# EasyEDA Pro project legacy_final.eprj, schematic Schematic4
Board Name: Schematic4; Create Date: 2026-05-15; Page Name: P1; Project Name: final; Schematic Name: Schematic4; Update Date: 2026-05-28
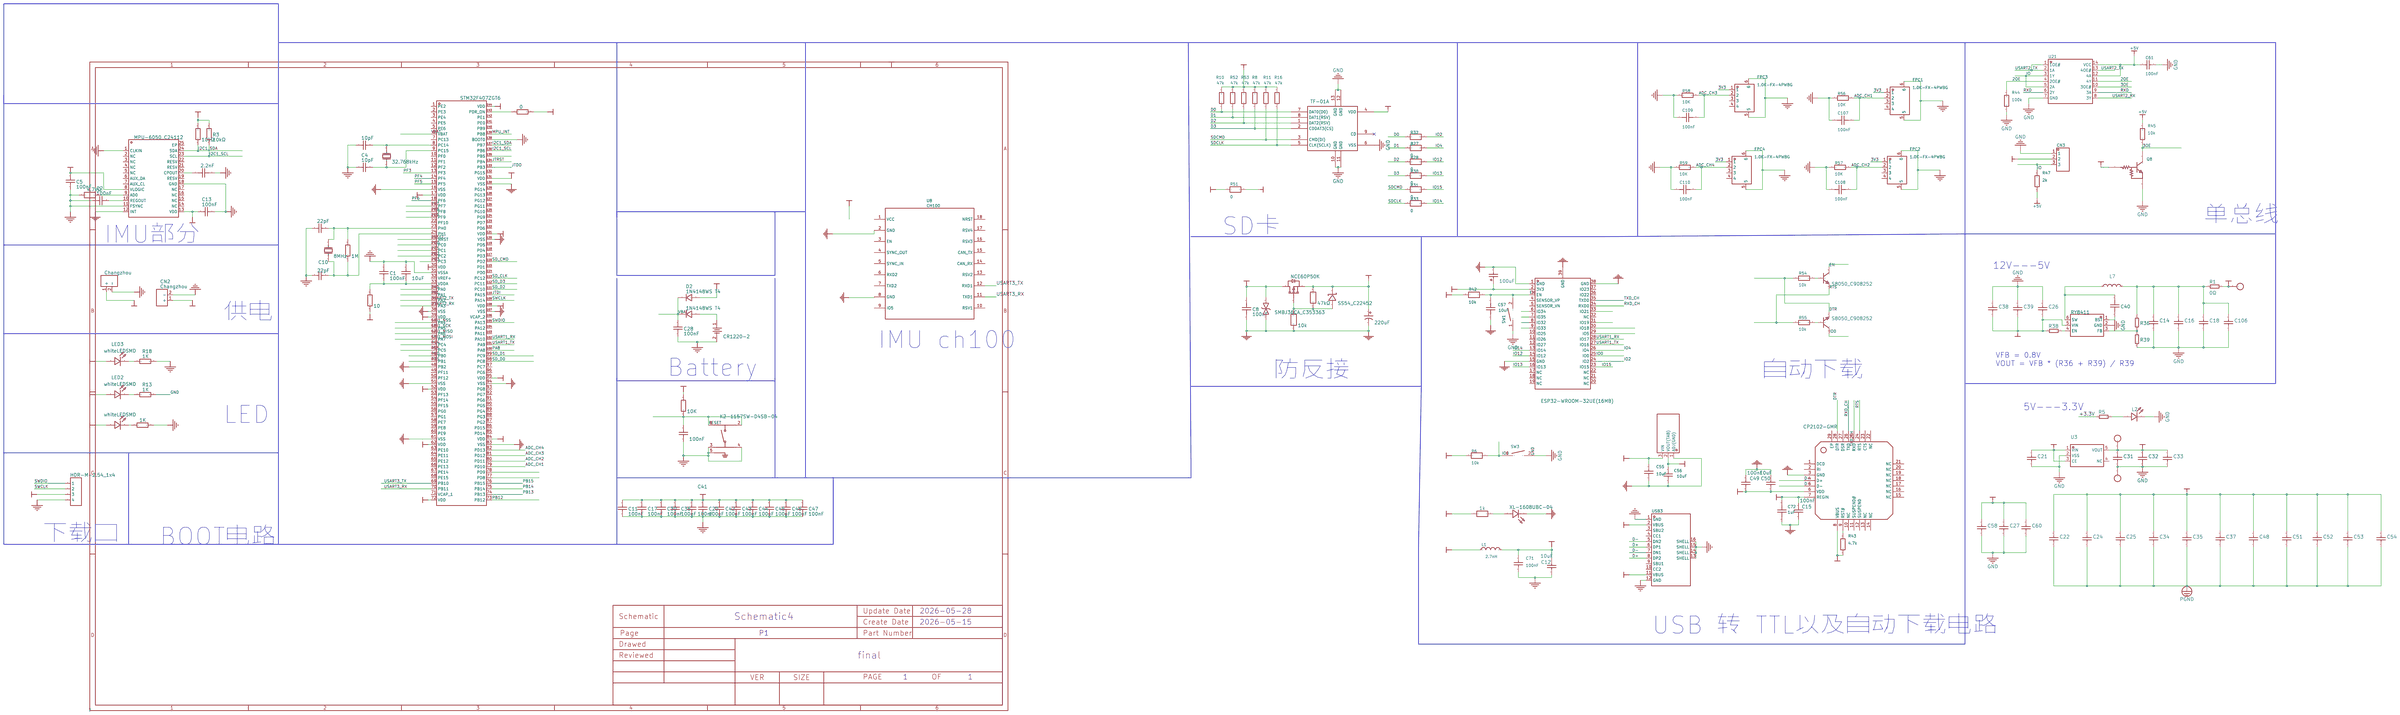
[diagram p0: schematic sheet]

## Parts
B1  CR1220-2  [BAT-SMD_CR1220-2]
C1  100nF  [C0402_NEW(1)]
C2  100nF  [C0402_NEW(1)]
C3  10pF  [C0603]
C4  10pF  [C0603]
C5  100nF  [C0402_NEW(1)]
C6  2.2nF  [C0603]
C7  22pF  [C0402]
C8  100nF  [C0805]
C9  100nF  [C0805]
C10  22pF  [C0402]
C11  100nF  [C0402_NEW(1)]
C12  10uF  [C0402(1)]
C13  100nF  [C0402_NEW(1)]
C14  100nF  [C0603_S]
C15  100nF  [C0402(1)]
C16  100nF  [C0603_S]
C17  100nF  [C0402_NEW(1)]
C18  100nF  [C0603_S]
C19  220uF  [CAP-TH_BD6.3-P2.50-D1.0-FD]
C20  100nF  [C0402_NEW(1)]
C21  100nF  [C0603_S]
C22  10uF  [C1206_S]
C23  100uF  [CAP-SMD_L3.5-W2.8-R-RD]
C24  10uF  [C1206_S]
C25  10uF  [C1206_S]
C26  100nF  [C0603_S]
C27  10uF  [C0603_S]
C28  100nF  [C0805]
C29  10uF  [C0805]
C30  100nF  [C0402_NEW(1)]
C31  100nF  [C0603_S]
C32  100nF  [C0603_S]
C33  100nF  [C0603_S]
C34  10uF  [C1206_S]
C35  10uF  [C1206_S]
C36  100nF  [C0402_NEW(1)]
C37  10uF  [C1206_S]
C38  10uF  [C0603_S]
C39  10uF  [C0603_S]
C40  100nF  [C0603_S_3]
C41  100nF  [C0402_NEW(1)]
C42  100nF  [C0402_NEW(1)]
C43  100nF  [C0402_NEW(1)]
C44  100nF  [C0402_NEW(1)]
C45  100nF  [C0402_NEW(1)]
C46  100nF  [C0402_NEW(1)]
C47  100nF  [C0402_NEW(1)]
C48  10uF  [C1206_S]
C49  100nF  [C0402(1)]
C50  10uF  [C0402(1)]
C51  10uF  [C1206_S]
C52  10uF  [C1206_S]
C53  10uF  [C1206_S]
C54  10uF  [C1206_S]
C55  10uF  [C0402_1]
C56  10uF  [C0402_1]
C57  10uF  [C0805_1]
C58  10uF  [C0603_S]
C60  10uF  [C0603_S]
C61  100nF  [C0402_NEW_1]
C71  100nF  [C0402_NEW_1]
C72  1uF  [C0402_1]
C106  100nF  [C0603_S]
C107  100nF  [C0603]
C108  100nF  [C0603]
C109  100nF  [C0603]
C110  100nF  [C0603]
CARD1  TF-01A  [TF-SMD_TF-01A]
CN1  Changzhou  [CONN-TH_XT30UPB-F]
CN2  Changzhou  [CONN-TH_XT30UPB-F(1)]
CN3  PH-3AW  [CONN-TH_PH-3AW]
CN5  5012  [TESTPOINT-TH_BD2.0_C9900010656]  (no BOM)
CN6  5012  [TESTPOINT-TH_BD2.0_C9900010656]  (no BOM)
CN7  5012  [TESTPOINT-TH_BD2.0_C9900010656]  (no BOM)
D1  SMBJ36CA_C353363  [SMB_L4.6-W3.6-LS5.3-BI]
D2  1N4148WS T4  [SOD-323_L1.8-W1.3-LS2.5-RD]
D3  1N4148WS T4  [SOD-323_L1.8-W1.3-LS2.5-RD]
D4  SS54_C22452  [SMA_L4.4-W2.8-LS5.4-R-RD]
FPC1  1.0K-FX-4PWBG  [CONN-SMD_1.0K-FX-4PWBG]
FPC2  1.0K-FX-4PWBG  [CONN-SMD_1.0K-FX-4PWBG]
FPC3  1.0K-FX-4PWBG  [CONN-SMD_1.0K-FX-4PWBG]
FPC4  1.0K-FX-4PWBG  [CONN-SMD_1.0K-FX-4PWBG]
J4  HDR-M-2.54_1x4  [HDR-M-2.54_1X4]
L1  2.7nH  [L0603]
L2  NCD0603R1  [LED0603_S]
L7  4.7uH  [IND-SMD_L2.5-W2.0]
LED2  whiteLEDSMD  [LED-0805]
LED3  whiteLEDSMD  [LED-0805]
LED6  XL-1608UBC-04  [LED0603-RD_BLUE]
LED7  whiteLEDSMD  [LED-0805]
Q1  NCE60P50K  [TO-252-2_L6.6-W6.1-P4.57-LS9.9-BR-CW]
Q2  S8050_C908252  [SOT-23-3_L2.9-W1.3-P1.90-LS2.4-BR]
Q5  S8050_C908252  [SOT-23-3_L2.9-W1.3-P1.90-LS2.4-BR]
Q8  LMUN2232LT1G  [SOT-23-3_L2.9-W1.3-P1.90-LS2.4-BR_1]
R1  0Ω  [R0603_S]
R2  10kΩ  [R0402]
R3  10kΩ  [R0402]
R4  4.7kΩ  [R0603]
R5  1kΩ  [R0603_S]
R6  10k  [R0402_1]
R7  10K  [R0805]
R8  47k  [R0402_2]
R9  1M  [R0603]
R10  47k  [R0402_2]
R11  47k  [R0402_2]
R12  10  [R0805]
R13  1K  [R0603]
R14  47kΩ  [R0805]
R15  0  [R0603]
R16  47k  [R0402_2]
R17  10k  [R0805]
R18  1K  [R0603]
R27  0  [R0603_1]
R28  0  [R0603_1]
R29  1K  [R0603]
R30  0  [R0603_1]
R31  0  [R0603_1]
R32  0  [R0603_1]
R33  0  [R0603_1]
R36  62kΩ  [R0603_S]
R37  1k  [R0603]
R38  10kΩ  [R0603_S]
R39  12kΩ  [R0603_S]
R42  10k  [R0402_1]
R43  4.7k  [R0402_1]
R44  100k  [R0603_1]
R45  10k  [R0402_1]
R47  2k  [R0402_2]
R51  0  [R0603_1]
R52  47k  [R0402_2]
R53  47k  [R0402_2]
R54  10k  [R0402_1]
R55  10k  [R0402_1]
R56  10K  [R0603]
R57  10K  [R0603]
R58  10K  [R0603]
R59  10K  [R0603]
SW1  TSA343G00-250J2  [SW-SMD_L4.0-W2.9-LS5.0]
SW2  K2-1157SW-D4SB-04  [KEY-SMD_4P-L6.2-W6.5-P4.50-LS8.0_K2-1157SW-XX]
SW3  TSA343G00-250J2  [SW-SMD_L4.0-W2.9-LS5.0]
U2  STM32F407ZGT6  [LQFP-144_L20.0-W20.0-P0.50-LS22.0-BL]
U3  XC6210B332MR  [SOT-23-5_L3.0-W1.7-P0.95-LS2.8-BR]
U4  MPU-6050_C24112  [QFN-24_L4.0-W4.0-P0.50-BL-EP2.6]
U5  RY8411  [SOT-23-6_L2.9-W1.6-P0.95-LS2.8-BR]
U6  ESP32-WROOM-32UE(16MB)  [WIFI-SMD_ESP32-WROOM-32UE]
U7  AMS1117-3.3_C347256  [SOT-89_L4.5-W2.5-P1.50-LS4.2-BR]
U8  CH100  [CH100-18]
U19  CP2102-GMR  [CP2102]
U21  SN74HC125PWR  [TSSOP-14_L5.0-W4.4-P0.65-LS6.5-BL]
USB3  TYPE-C-31-M-22  [USB-C-SMD_TYPE-C-31-M-22]
X2  8MHz  [OSC-SMD_L5.0-W3.2]
X3  32.768kHz  [OSC-SMD_L2.0-W1.2]

## Library data of the parts
B1 = CR1220-2: Supplier: LCSC; Manufacturer: Q&amp;J; image: //image.lceda.cn/szlcsc/C70381.jpg; Supplier Part: C70381; Paste Type: expand
C1 C2 C5 C11 C13 C17 C20 C30 C36 C41-C47 = 100nF_C0402_NEW: Supplier: LCSC; Manufacturer Part: CL05B104KO5NNNC; Manufacturer: SAMSUNG(三星); Supplier Part: C1525; Paste Type: base; JLCPCB Part Class: Basic Part
C3 = 10pF: Supplier: LCSC; Manufacturer Part: CL10C100JB8NNNC; Manufacturer: SAMSUNG(三星); Supplier Part: C1634; JLCPCB Part Class: Basic Part
C4 = 10pF_C0603: Supplier: LCSC; Manufacturer Part: CL10C100JB8NNNC; Manufacturer: SAMSUNG(三星); Supplier Part: C1634; JLCPCB Part Class: Basic Part
C6 = 2.2nF: Supplier: LCSC; Supplier Part: C882578; Manufacturer: muRata(村田); Manufacturer Part: GCM1885C1H222FA16D; JLCPCB Part Class: Extended Part
C7 = 22pF: Supplier: LCSC; Manufacturer: FH; Manufacturer Part: 0402CG220J500NT; Supplier Part: C1555; JLCPCB Part Class: Basic Part
C8 = 100nF_C0805: Supplier: LCSC; Manufacturer: MuRata; Manufacturer Part: GRM21BR71H104KA01L; Supplier Part: C77082; Paste Type: base; JLCPCB Part Class: Extended Part
C9 C28 = 100nF_C0805(1): Supplier: LCSC; Manufacturer Part: CC0805KRX7R9BB104; Manufacturer: YAGEO; Supplier Part: C49678; Paste Type: base
C10 = 22pF_C0402: Supplier: LCSC; Manufacturer: FH; Manufacturer Part: 0402CG220J500NT; Supplier Part: C1555; JLCPCB Part Class: Basic Part
C12 C50 = 10uF_C0402: Supplier: LCSC; Manufacturer Part: CL05A106MQ5NUNC; Manufacturer: SAMSUNG; Supplier Part: C15525; Paste Type: base; JLCPCB SMD: Yes
C14 C16 C18 C21 C26 C31-C33 C106 = 0603B104K500NT: LCSC Part Name: 100nF ±10% 50V; Supplier Part: C30926; Manufacturer: FH(风华); Supplier Footprint: 0603; JLCPCB Part Class: Extended Part; Datasheet: https://atta.szlcsc.com/upload/public/pdf/source/20200305/C486355_26A10D38EF8C2A5C37091D0039909270.pdf; Supplier: LCSC; Tolerance: ±10%; Voltage Rated: 50V; Temperature Coefficient: X7R; Pin Type: IN; Check: true
C15 C49 = 100nF_C0402: Supplier: LCSC; Manufacturer Part: CL05B104KO5NNNC; Manufacturer: SAMSUNG; Supplier Part: C1525; Paste Type: base; JLCPCB SMD: Yes
C19 = 220uF: Supplier: LCSC; Manufacturer: ValuePro; Manufacturer Part: 220uF 16V Black high frequency; Supplier Part: C35799; JLCPCB Part Class: Extended Part
C22 C24 C25 C34 C35 C37 C48 C51-C54 = CL31A106KBHNNNE: LCSC Part Name: 10uF ±10% 50V; Supplier Part: C13585; Manufacturer: SAMSUNG(三星); Supplier Footprint: 1206; JLCPCB Part Class: Basic Part; Datasheet: https://atta.szlcsc.com/upload/public/pdf/source/20160218/1457707763339.pdf; Supplier: LCSC; Tolerance: ±10%; Voltage Rated: 50V; Temperature Coefficient: X5R; Pin Type: IN; 值: 10UF; Check: true
C23 = 100uF: Supplier: LCSC; Manufacturer: Xiangyee; Manufacturer Part: CA45-B010K107T; Supplier Part: C122644; JLCPCB Part Class: Extended Part
C27 C38 C39 C58 C60 = CL10A106MA8NRNC: LCSC Part Name: 10uF ±20% 25V; Supplier Part: C96446; Manufacturer: SAMSUNG(三星); Supplier Footprint: 0603; JLCPCB Part Class: Basic Part; Datasheet: https://atta.szlcsc.com/upload/public/pdf/source/20160218/1457707763339.pdf; Supplier: LCSC; Tolerance: ±20%; Voltage Rated: 25V; Temperature Coefficient: X5R; Pin Type: IN; Check: true
C29 = 10uF_C0805: Supplier: LCSC; Manufacturer Part: CL21A106KAYNNNE; Manufacturer: SAMSUNG; Supplier Part: C15850; Paste Type: base
C40 = CC0603KRX7R9BB104: LCSC Part Name: 100nF ±10% 50V; Supplier Part: C14663; Manufacturer: YAGEO(国巨); Supplier Footprint: 0603; JLCPCB Part Class: Basic Part; Datasheet: https://atta.szlcsc.com/upload/public/pdf/source/20180910/C282072_33301C7F631E79921B82A8DAC6BCC5B3.pdf; Supplier: LCSC; Tolerance: ±10%; Voltage Rated: 50V; Temperature Coefficient: X7R; Check: true
C55 C56 = CL05A106MQ5NUNC: LCSC Part Name: 10uF ±20% 6.3V; Supplier Part: C15525; Manufacturer: SAMSUNG(三星); Supplier Footprint: 0402; Datasheet: https://atta.szlcsc.com/upload/public/pdf/source/20220823/2B02EE04F8F211D38A52DCB16EB6BEBA.pdf; Supplier: LCSC; Tolerance: ±20%; Voltage Rated: 6.3V; Temperature Coefficient: X5R
C57 = GRM21BR61H106KE43L: LCSC Part Name: 10uF ±10% 50V; Supplier Part: C440198; Manufacturer: muRata(村田); Supplier Footprint: 0805; Datasheet: https://atta.szlcsc.com/upload/public/pdf/source/20191220/C440198_2DEA1B9834E321C8893F7972E9DFE5B0.pdf; Supplier: LCSC; Tolerance: ±10%; Voltage Rated: 50V; Temperature Coefficient: X5R
C61 C71 = CL05B104KO5NNNC: LCSC Part Name: 100nF ±10% 16V; Supplier Part: C1525; Manufacturer: SAMSUNG(三星); Supplier Footprint: 0402; Datasheet: https://atta.szlcsc.com/upload/public/pdf/source/20160103/1457707674891.pdf; Supplier: LCSC; Tolerance: ±10%; Voltage Rated: 16V; Temperature Coefficient: X7R
C72 = CL05A105KA5NQNC: LCSC Part Name: 1uF ±10% 25V; Supplier Part: C52923; Manufacturer: SAMSUNG(三星); Supplier Footprint: 0402; Datasheet: https://atta.szlcsc.com/upload/public/pdf/source/20160103/1457707735223.pdf; Supplier: LCSC; Tolerance: ±10%; Voltage Rated: 25V; Temperature Coefficient: X5R
C107-C110 = CAP_0603: Supplier Footprint: 0603
CARD1 = TF-01A: Supplier: LCSC; Manufacturer: HRO; Supplier Part: C91145
CN1 = Changzhou: Supplier: LCSC; Supplier Part: C108769; Manufacturer: Changzhou Amass Elec; Manufacturer Part: XT30UPB-F; JLCPCB Part Class: Extended Part
CN2 = Changzhou_CONN-TH_XT30UPB-F: Supplier: LCSC; Supplier Part: C108769; Manufacturer: Changzhou Amass Elec; Manufacturer Part: XT30UPB-F; JLCPCB Part Class: Extended Part
CN3 = PH-3AW_C10400: LCSC Part Name: PH 2mm 1x3P 卧插; Supplier Part: C10400; Manufacturer: BOOMELE(博穆精密); Supplier Footprint: 弯插,P=2mm; Datasheet: https://atta.szlcsc.com/upload/public/pdf/source/20151118/1457707577338.pdf; Supplier: LCSC; Reference Series: PH; Pitch: 2mm; Pins Structure: 1x3P; Number of Rows: 1; Number of PINs Per Row: 3
CN5-CN7 = 5012: LCSC Part Name: 测试点; Supplier Part: C2906766; Manufacturer: Keystone; JLCPCB Part Class: ExtendedPart; Datasheet: https://atta.szlcsc.com/upload/public/pdf/source/20211102/12102DF701EA335825673F0350517149.pdf; Supplier: LCSC; Check: true
D1 = SMBJ36CA_C353363: Supplier: LCSC; Supplier Part: C353363; Manufacturer: 晶导微电子; Manufacturer Part: SMBJ36CA; JLCPCB Part Class: Extended Part
D2 = 1N4148WS T4_SOD-323_L1.8-W1.3-LS2.5-RD: Supplier: LCSC; Manufacturer: CJ; image: //image.lceda.cn/szlcsc/C2128.jpg; Supplier Part: C2128; Paste Type: base
D3 = 1N4148WS T4: Supplier: LCSC; Manufacturer: CJ; image: //image.lceda.cn/szlcsc/C2128.jpg; Supplier Part: C2128; Paste Type: base
D4 = SS54_C22452: Supplier: LCSC; Manufacturer Part: SS54; Manufacturer: MDD; Supplier Part: C22452; JLCPCB Part Class: Basic Part
FPC1-FPC4 = 1.0K-FX-4PWBG: LCSC Part Name: 间距:1mm P数:4P 抽屉式 下接; Supplier Part: C2914091; Manufacturer: HDGC(华德共创); Supplier Footprint: SMD,P=1mm,卧贴; JLCPCB Part Class: 扩展库; Datasheet: https://item.szlcsc.com/datasheet/1.0K-FX-4PWBG/3200855.html; Supplier: LCSC; Locking Feature: 抽屉式; Contact Type: 下接; Number of Contacts: 4P; Pitch: 1mm; Mounting Type: 卧贴; FFC, FCB Thickness: 0.3mm; Height Above Board: 2.5mm; Operating Temperature: -20℃~+85℃
J4 = HDR-M-2.54_1x4: Supplier Part: C358686; Supplier: LCSC; Manufacturer: MINTRON; Manufacturer Part: MTP125-1104S1
L1 = VHF160808H2N7ST: 电感值:2.7nH;精度:±0.3nH;额定电流:400mA;饱和电流(Isat):-;直流电阻(DCR):200m;; LCSC Part Name: 2.7nH ±0.3nH 400mA 200m; Supplier Part: C83929; Manufacturer: FH(风华); Supplier Footprint: 0603; Datasheet: https://atta.szlcsc.com/upload/public/pdf/source/20161024/1477288574938.pdf; Supplier: LCSC; Tolerance: ±0.3nH; Rated Current: 400mA; DC Resistance (DCR): 200m
L2 = NCD0603R1_C84263: LCSC Part Name: 红灯 0603红灯   正贴; Supplier Part: C84263; Manufacturer: 国星光电; Supplier Footprint: 0603; JLCPCB Part Class: Extended Part; Datasheet: https://atta.szlcsc.com/upload/public/pdf/source/20200820/C84263_DABC6A75E58F576973B407FDBA283D60.pdf; Supplier: LCSC; Emitted Color: 红色; Forward Voltage (VF): 1.6V~2.6V; Forward Current: 20mA; Power Dissipation: 65mW; Lens Color: 无色透明; Dominant Wavelength: 615nm~630nm; Luminous Intensity: 80mcd~220mcd; Viewing Angle: 130°; Operating Temperature: -30℃~+85℃; Check: true
L7 = MPIH252010-4R7M-LF: LCSC Part Name: 4.7uH ±20% 1A 275mΩ; Supplier Part: C490449; Manufacturer: microgate(麦捷科技); Supplier Footprint: SMD; JLCPCB Part Class: Extended Part; Datasheet: https://atta.szlcsc.com/upload/public/pdf/source/20200707/C490443_2060EC88E48E101AE91DC68C352BCAF4.pdf; Supplier: LCSC; Tolerance: ±20%; Rated Current: 1A; DC Resistance (DCR): 275mΩ; Check: true
LED2 LED3 = whiteLEDSMD_LED-0805: Supplier: LCSC; Manufacturer: KENTO; image: //image.lceda.cn/szlcsc/C34499.jpg; Supplier Part: C34499; Paste Type: base
LED6 = XL-1608UBC-04: Supplier: LCSC; Supplier Part: C965807; Manufacturer: XINGLIGHT(成兴光); JLCPCB Part Class: Extended Part
LED7 = whiteLEDSMD: Supplier: LCSC; Manufacturer: KENTO; image: //image.lceda.cn/szlcsc/C34499.jpg; Supplier Part: C34499; Paste Type: base
Q1 = NCE60P50K: Supplier: LCSC; Manufacturer: Ncepower; Supplier Part: C130104; JLCPCB Part Class: Extend
Q2 = S8050_C908252: Supplier: LCSC; Supplier Part: C908252; Manufacturer: FUXINSEMI; Manufacturer Part: S8050; JLCPCB Part Class: Extended Part
Q5 = S8050_C908252_SOT-23-3_L2.9-W1.3-P1.90-LS2.4-BR: Supplier: LCSC; Supplier Part: C908252; Manufacturer: FUXINSEMI; Manufacturer Part: S8050; JLCPCB Part Class: Extended Part
Q8 = LMUN2232LT1G: LCSC Part Name: 1个NPN-预偏置 100mA 50V; Supplier Part: C129120; Manufacturer: LRC(乐山无线电); Supplier Footprint: SOT-23; Datasheet: https://atta.szlcsc.com/upload/public/pdf/source/20170914/C129120_1505359899526968091.pdf; Supplier: LCSC; Transistor Type: NPN; Power Dissipation (Pd): 246mW; Collector Current (Ic): 100mA; Collector-Emitter Breakdown Voltage (Vceo): 50V
R1 = R0603_S: Pin Type: IN; Manufacturer: UNI-ROYAL(厚声); Manufacturer Part: 0805W8F1001T5E; Supplier: LCSC; Supplier Part: C21189; 美岩编码: A00010; 单价: 0.009222; Check: true
R2 = 10kΩ: Supplier: LCSC; Supplier Part: C191568; Manufacturer: PANASONIC; Manufacturer Part: ERA-2AED103X; Resistance: 10K; JLCPCB Part Class: Extended Part
R3 = 10kΩ_R0402: Supplier: LCSC; Supplier Part: C191568; Manufacturer: PANASONIC; Manufacturer Part: ERA-2AED103X; Resistance: 10K; JLCPCB Part Class: Extended Part
R4 = 4.7kΩ: Supplier: LCSC; Supplier Part: C509091; Manufacturer: PANASONIC; Manufacturer Part: ERA3ARB472V; JLCPCB Part Class: Extended Part
R5 = RC0603FR-071KL: LCSC Part Name: 1kΩ ±1% 100mW; Supplier Part: C22548; Manufacturer: YAGEO(国巨); Supplier Footprint: 0603; JLCPCB Part Class: Extended Part; Datasheet: https://atta.szlcsc.com/upload/public/pdf/source/20180312/7BD3618A8B6324EA6280B0497A051AB7.pdf; Supplier: LCSC; Type: 厚膜电阻; Tolerance: ±1%; Power(Watts): 100mW; Temperature Coefficient: ±100ppm/℃; Overload Voltage (Max): 75V; Operating Temperature Range: -55℃~+155℃; Pin Type: IN; Check: true
R6 R42 = CR-02JL6---10K: 精度:±5%;功率:1/16W;温度系数:±100ppm/;阻值:10k;电阻类型:厚膜电阻;最大工作电压:50V;工作温度范围:-55~+155;; LCSC Part Name: 10k ±5%; Supplier Part: C409612; Manufacturer: Viking(光颉); Supplier Footprint: 0402; Datasheet: https://atta.szlcsc.com/upload/public/pdf/source/20190806/C409612_48417C4A131BC5FA284E88096739C009.pdf; Supplier: LCSC; Tolerance: ±5%; Power(Watts): 1/16W; Temperature Coefficient: ±100ppm/; Type: 厚膜电阻; Overload Voltage (Max): 50V; Operating Temperature Range: -55~+155
R7 = 10K: Supplier: LCSC; Manufacturer: UniOhm; Manufacturer Part: 0805W8F1002T5E; Supplier Part: C17414; Paste Type: base
R8 R10 R11 R16 R52 R53 = RC0402FR-0747KL: 电阻类型:厚膜电阻;阻值:47k;精度:±1%;功率:62.5mW;温度系数:±100ppm/;最大工作电压:50V;工作温度范围:-55~+155;; LCSC Part Name: 47k ±1% 62.5mW; Supplier Part: C93943; Manufacturer: YAGEO(国巨); Supplier Footprint: 0402; Datasheet: https://atta.szlcsc.com/upload/public/pdf/source/20170908/C93943_1504870168965958150.pdf; Supplier: LCSC; Type: 厚膜电阻; Tolerance: ±1%; Power(Watts): 62.5mW; Temperature Coefficient: ±100ppm/; Overload Voltage (Max): 50V; Operating Temperature Range: -55~+155
R9 = 1M: Supplier: LCSC; Manufacturer: UniOhm; Manufacturer Part: 0603WAF1004T5E; Supplier Part: C22935; Paste Type: base
R12 = 10: Supplier: LCSC; Manufacturer: UniOhm; Manufacturer Part: 0805W8F100JT5E; Supplier Part: C17415; Paste Type: base
R13 R18 = 1K_R0603: Supplier: LCSC; Manufacturer: UniOhm; Manufacturer Part: 0603WAF1001T5E; Supplier Part: C21190; Paste Type: base
R14 = 47kΩ: Supplier: LCSC; Supplier Part: C473310; Manufacturer: PANASONIC; Manufacturer Part: ERA6AEB473V; JLCPCB Part Class: Extended Part
R15 = 0_: Supplier: LCSC; Manufacturer: UniOhm; Manufacturer Part: 0603WAF0000T5E; Supplier Part: C21189; Paste Type: base
R17 = 10kΩ_R0805: Supplier: LCSC; Supplier Part: C509088; Manufacturer: PANASONIC; Manufacturer Part: ERA6ARB103V; Resistance: 10kΩ; JLCPCB Part Class: Extended Part
R27 R28 R30-R33 R51 = WR06X000 PTL: 电阻类型:厚膜电阻;阻值:0;功率:-;最大工作电压:-;; Supplier Part: C2909476; Manufacturer: Walsin(华新科); Supplier Footprint: 0603; Datasheet: https://atta.szlcsc.com/upload/public/pdf/source/20191217/C470037_D99261402F77DA8B1D609223749D445A.pdf; Supplier: LCSC; Type: 厚膜电阻
R29 = 1K: Supplier: LCSC; Manufacturer: UniOhm; Manufacturer Part: 0603WAF1001T5E; Supplier Part: C21190; Paste Type: base
R36 = 0603WAF6202T5E: LCSC Part Name: 62kΩ ±1% 100mW 厚膜电阻; Supplier Part: C23221; Manufacturer: UNI-ROYAL(厚声); Supplier Footprint: 0603; JLCPCB Part Class: Basic Part; Datasheet: https://atta.szlcsc.com/upload/public/pdf/source/20200306/C422600_1E6D84923E4A46A82E41ADD87F860B5C.pdf; Supplier: LCSC; Tolerance: ±1%; Power(Watts): 100mW; Overload Voltage (Max): 75V; Temperature Coefficient: ±100ppm/℃; Type: 厚膜电阻; Operating Temperature Range: -55℃~+155℃; Pin Type: IN; 美岩编码: A00010; 单价: 0.009222; Check: true
R37 = 1k_R0603(1)
R38 = 0603WAF1002T5E: LCSC Part Name: 10kΩ ±1% 100mW 厚膜电阻; Supplier Part: C25804; Manufacturer: UNI-ROYAL(厚声); Supplier Footprint: 0603; JLCPCB Part Class: Basic Part; Datasheet: https://atta.szlcsc.com/upload/public/pdf/source/20200306/C422600_1E6D84923E4A46A82E41ADD87F860B5C.pdf; Supplier: LCSC; Tolerance: ±1%; Power(Watts): 100mW; Overload Voltage (Max): 75V; Temperature Coefficient: ±100ppm/℃; Type: 厚膜电阻; Operating Temperature Range: -55℃~+155℃; Pin Type: IN; Check: true
R39 = 0603WAF1202T5E: LCSC Part Name: 12kΩ ±1% 100mW 厚膜电阻; Supplier Part: C22790; Manufacturer: UNI-ROYAL(厚声); Supplier Footprint: 0603; JLCPCB Part Class: Basic Part; Datasheet: https://atta.szlcsc.com/upload/public/pdf/source/20200306/C422600_1E6D84923E4A46A82E41ADD87F860B5C.pdf; Supplier: LCSC; Tolerance: ±1%; Power(Watts): 100mW; Overload Voltage (Max): 75V; Temperature Coefficient: ±100ppm/℃; Type: 厚膜电阻; Operating Temperature Range: -55℃~+155℃; Pin Type: IN; 美岩编码: A00010; 单价: 0.009222; Check: true
R43 = 0402WGF4701TCE: 电阻类型:厚膜电阻;阻值:4.7k;精度:±1%;功率:1/16W;温度系数:±100ppm/;最大工作电压:50V;工作温度范围:-55~+155;; LCSC Part Name: 4.7k ±1% 1/16W; Supplier Part: C25900; Manufacturer: UNI-ROYAL(厚声); Supplier Footprint: 0402; Datasheet: https://atta.szlcsc.com/upload/public/pdf/source/20200306/C422600_1E6D84923E4A46A82E41ADD87F860B5C.pdf; Supplier: LCSC; Type: 厚膜电阻; Tolerance: ±1%; Power(Watts): 1/16W; Temperature Coefficient: ±100ppm/; Overload Voltage (Max): 50V; Operating Temperature Range: -55~+155
R44 = 0603WAF1003T5E: 电阻类型:厚膜电阻;阻值:100k;精度:±1%;功率:100mW;温度系数:±100ppm/;最大工作电压:75V;工作温度范围:-55~+155;; LCSC Part Name: 100k ±1% 100mW; Supplier Part: C25803; Manufacturer: UNI-ROYAL(厚声); Supplier Footprint: 0603; Datasheet: https://atta.szlcsc.com/upload/public/pdf/source/20200306/C422600_1E6D84923E4A46A82E41ADD87F860B5C.pdf; Supplier: LCSC; Type: 厚膜电阻; Tolerance: ±1%; Power(Watts): 100mW; Temperature Coefficient: ±100ppm/; Overload Voltage (Max): 75V; Operating Temperature Range: -55~+155
R45 R54 R55 = 0402WGF1002TCE: 电阻类型:厚膜电阻;阻值:10k;精度:±1%;功率:62.5mW;温度系数:±100ppm/;最大工作电压:50V;工作温度范围:-55~+155;; LCSC Part Name: 10k ±1% 62.5mW; Supplier Part: C25744; Manufacturer: UNI-ROYAL(厚声); Supplier Footprint: 0402; Datasheet: https://atta.szlcsc.com/upload/public/pdf/source/20200306/C422600_1E6D84923E4A46A82E41ADD87F860B5C.pdf; Supplier: LCSC; Type: 厚膜电阻; Tolerance: ±1%; Power(Watts): 62.5mW; Temperature Coefficient: ±100ppm/; Overload Voltage (Max): 50V; Operating Temperature Range: -55~+155
R47 = 0402WGF2001TCE: 电阻类型:厚膜电阻;阻值:2k;精度:±1%;功率:62.5mW;温度系数:±100ppm/;最大工作电压:50V;工作温度范围:-55~+155;; LCSC Part Name: 2k ±1% 62.5mW; Supplier Part: C4109; Manufacturer: UNI-ROYAL(厚声); Supplier Footprint: 0402; Datasheet: https://atta.szlcsc.com/upload/public/pdf/source/20200306/C422600_1E6D84923E4A46A82E41ADD87F860B5C.pdf; Supplier: LCSC; Type: 厚膜电阻; Tolerance: ±1%; Power(Watts): 62.5mW; Temperature Coefficient: ±100ppm/; Overload Voltage (Max): 50V; Operating Temperature Range: -55~+155
R56-R59 = Res_0603: Supplier Footprint: 0603
SW1 SW3 = TSA343G00-250J2: 触点电流:50mA;额定电压(DC):12V;绝缘电阻:100M;电路结构:单刀单掷;安装方式:立贴;按钮形状:圆形按钮;按钮/盖帽颜色:黑色;带灯:无;作用力:250gf@±50gf;机械寿命:50000;工作温度:-25~+70;引脚样式:SMD接片;开关长度:3.95mm;开关宽度:2.9mm;开关高度:2mm;带支架:否;; LCSC Part Name: 3*4 两脚小龟不带柱  250gf; Supplier Part: C354946; Manufacturer: BRIGHT(博瑞泰); Supplier Footprint: SMD; Datasheet: https://atta.szlcsc.com/upload/public/pdf/source/20190426/C354946_6B70DFBDFA823D17B8EB46FB9599F693.pdf; Supplier: LCSC; Contact Current: 50mA; Voltage Rating (DC): 12V; Insulation Resistance: 100M; Circuit: 单刀单掷; Mounting Style: 立贴; Actuator Style: 圆形按钮; Actuator/Cap Color: 黑色; With Lamp: 无; Operating Force: 250gf@±50gf; Mechanical Life: 50000; Operating Temperature: -25~+70; Pin Style: SMD接片; Switch Length: 3.95mm; Switch Width: 2.9mm; Switch Height: 2mm; Strike Gundam: 否
SW2 = K2-1157SW-D4SB-04: Supplier: LCSC; Supplier Part: C136660; Manufacturer: Rectangular Connectors - Contacts
U2 = STM32F407ZGT6: tags: STM32; Supplier Part: C19156; Supplier: LCSC; Manufacturer: ST; image: http://image.lceda.cn/szlcsc/C19156.jpg; Paste Type: recommend
U3 = XC6210B332MR_C424705: Supplier Part: C424705; Manufacturer: TOREX(特瑞仕); Supplier Footprint: SOT-25; JLCPCB Part Class: Extended Part; Datasheet: https://atta.szlcsc.com/upload/public/pdf/source/20190903/C424705_1DFB2113A9A78D399905DBF688657204.pdf; Supplier: LCSC; Output Type: 固定; Output Polarity: 正; Number of Outputs: 1; Maximum Input Voltage: 6V; Output Voltage: 3.3V; Dropout Voltage: 75mV@(100mA); Output Current: 900mA; Power Supply Rejection Ratio (PSRR): 60dB@(1kHz); Power Supply Rejection Ratio (PRSS): 90dB@(100Hz),60dB@(100kHz); Check: true
U4 = MPU-6050_C24112: Supplier: LCSC; Manufacturer: InvenSense; Manufacturer Part: MPU-6050; image: //image.lceda.cn/szlcsc/C24112.jpg; Supplier Part: C24112; Paste Type: base
U5 = TD1466: Supplier: LCSC; Supplier Part: C185109; Manufacturer: JoulWatt Tech; Manufacturer Part: JW5026; JLCPCB Part Class: Extended Part; Check: true
U6 = ESP32-WROOM-32UE(16MB): Supplier: LCSC; Supplier Part: C701346; Manufacturer: ESPRESSIF(乐鑫); JLCPCB Part Class: Extended Part
U7 = AMS1117-3.3_C347256: Supplier: LCSC; Supplier Part: C347256; Manufacturer: Youtai Semiconductor Co., Ltd.; Manufacturer Part: AMS1117-3.3; JLCPCB Part Class: Extended Part
U8 = CH100
U19 = CP2102-GMR: Supplier: LCSC; Manufacturer: SILICON LABS; Supplier Part: C6568; JLCPCB Part Class: Basic Part
U21 = SN74HC125PWR: 类型:缓冲器，非反相;电源电压:2V~6V;输入类型:-;输出类型:三态;低电平输出电流(IOL):7.8mA;高电平输出电流(IOH):7.8mA;工作温度:-40~+85;; Supplier Part: C132994; Manufacturer: TI(德州仪器); Supplier Footprint: TSSOP-14; Datasheet: https://atta.szlcsc.com/upload/public/pdf/source/20170930/C132994_1506736365150997346.pdf; Supplier: LCSC; Type: 缓冲器，非反相; Supply Voltage: 2V~6V; output type: 三态; Current-OutputLow: 7.8mA; Current-OutputHigh: 7.8mA; Operating temperature: -40~+85
USB3 = TYPE-C-31-M-22: 连接器类型:Type-C;标准:-;公母:母座;触点数量:16;端口数量:1;安装方式:卧贴;额定电流 - 电源:5A;工作温度范围:-30~+85;; LCSC Part Name: TYPE-C母座 8.94mm7.61mm 12PIN; Supplier Part: C530612; Manufacturer: 韩国韩荣; Supplier Footprint: SMD; Datasheet: https://atta.szlcsc.com/upload/public/pdf/source/20210810/12D503FF336C7BD0193561643DF4810C.pdf; Supplier: LCSC; Connector Type: Type-C; Gender: 母座; Number of Contacts: 16; Number of Ports: 1; Mounting Style: 卧贴; Current Rating - Power (Max): 5A; Operating Temperature Range: -30~+85
X2 = 8MHz: Supplier: LCSC; Manufacturer: YXC; Manufacturer Part: X50328MSB2GI; Supplier Part: C115962; Paste Type: base
X3 = 32.768kHz: Supplier: LCSC; Supplier Part: C276423; Manufacturer: ABRACON; Manufacturer Part: ABS06-32.768KHZ-T; JLCPCB Part Class: Extended Part

## Nets
3V3: C49.2 C50.2 C56.2 FPC1.1 FPC2.1 FPC3.1 FPC4.1 U7.2(VOUT(TAB)) U19.6(VDD)
+3.3V: C5.1 C11.2 C13.2 C17.2 C20.2 C23.1 C30.2 C31.2 C32.2 C33.2 C36.2 C41.2 C42.2 C43.2 C44.2 C45.2 C46.2 C47.2 CN5.1 D2.2(A) J4.3 LED3.1(A) LED7.1(A) R2.2 R3.2 R5.1 R6.2 R7.2 R12.1 R15.2 R42.2 R51.1 U2.17(VDD) U2.30(VDD) U2.39(VDD) U2.52(VDD) U2.62(VDD) U2.72(VDD) U2.84(VDD) U2.95(VDD) U2.108(VDD) U2.121(VDD) U2.131(VDD) U2.144(VDD) U3.5(VOUT) U4.8(VLOGIC) U4.13(VDD) U6.2(3V3)
+5V: C21.2 C61.1 CN7.1 LED2.1(A) R1.2 R45.2 R47.1 U3.1(VIN) U3.3(CE) U21.12(4A) U21.14(VCC)
+12V: C19.1 C22.2 C24.2 C25.2 C26.1 C27.2 C34.2 C35.2 C37.2 C38.2 C39.1 C48.2 C51.2 C52.2 C53.2 C54.2 C58.2 C60.2 CN3.2 D4.2(K) Q1.3(S) Q8.1(B) R14.2 R38.2 U5.5(VIN)
GND: B1.2 C1.2 C2.2 C3.1 C4.1 C5.2 C6.2 C7.1 C8.2 C9.1 C10.1 C11.1 C13.1 C14.1 C16.1 C17.1 C18.1 C19.2 C20.1 C21.1 C23.2 C26.2 C27.1 C28.1 C29.2 C30.1 C31.1 C32.1 C33.1 C36.1 C38.1 C39.2 C41.1 C42.1 C43.1 C44.1 C45.1 C46.1 C47.1 C57.1 C58.1 C60.1 C61.2 C106.1 C107.1 C108.1 C109.1 C110.1 CARD1.6(VSS) CARD1.10(GND) CARD1.11(GND) CARD1.12(GND) CARD1.13(GND) CN1.2(-) CN2.2(-) CN3.1 CN6.1 D1.1 FPC1.5 FPC1.6 FPC2.5 FPC2.6 FPC3.5 FPC3.6 FPC4.5 FPC4.6 J4.4 L2.2 Q8.2(E) R4.1 R13.2 R17.1 R18.2 R29.2 R39.2 R44.1 R56.1 R57.1 R58.1 R59.1 SW1.1 SW2.3 SW2.4 SW2.5 SW3.2 U2.16(VSS) U2.31(VSSA) U2.38(VSS) U2.48(PB2) U2.51(VSS) U2.61(VSS) U2.83(VSS) U2.94(VSS) U2.107(VSS) U2.120(VSS) U2.130(VSS) U2.138(BOOT0) U3.2(VSS) U4.1(CLKIN) U4.11(FSYNC) U4.12(INT) U4.18(GND) U5.2(GND) U6.1(GND) U6.15(GND) U6.38(GND) U6.39(GND) U8.2(GND) U8.8(GND) U21.7(GND)
GND_USB: C12.2 C15.2 C49.1 C50.1 C55.1 C56.1 C71.1 C72.1 LED6.1(K) U7.1(ADJ(GND)) U19.3(GND) USB3.1(GND) USB3.12(GND) USB3.13(SHELL) USB3.14(SHELL) USB3.15(SHELL) USB3.16(SHELL)
PGND: C22.1 C24.1 C25.1 C34.1 C35.1 C37.1 C48.1 C51.1 C52.1 C53.1 C54.1
VBAT: C28.2 D2.1(K) D3.1(K) U2.6(VBAT)
2OE: R44.2 U21.4(2OE#) U21.11(4Y)
3OE: Q8.3(C) R45.1 U21.10(3OE#)
ADC_CH1: C107.2 FPC1.2 R56.2 U2.79(PD10)
ADC_CH2: C108.2 FPC2.2 R57.2 U2.80(PD11)
ADC_CH3: C109.2 FPC3.2 R58.2 U2.81(PD12)
ADC_CH4: C110.2 FPC4.2 R59.2 U2.82(PD13)
D0: CARD1.7(DAT0(D0)) R10.1 R32.1
D1: CARD1.8(DAT1(RSV)) R27.1 R52.1
D2: CARD1.1(DAT2(RSV)) R28.1 R53.1
D3: CARD1.2(CDDAT3(CS)) R8.1 R30.1
D+: U19.4(D+) USB3.6(DP1) USB3.8(DP2)
D-: U19.5(D-) USB3.5(DN2) USB3.7(DN1)
DTR: Q2.2(E) R54.1 U19.28(DTR)
EN: C57.2 Q5.3(C) R42.1 SW1.2 U6.3(EN)
I2C1_SCL: R3.1 U2.136(PB6) U4.23(SCL)
I2C1_SDA: R2.1 U2.137(PB7) U4.24(SDA)
IO: CN3.3 R47.2 U21.3(1Y) U21.5(2A)
IO0: Q2.3(C) R6.1 SW3.1 U6.25(IO0)
IO2: R32.2 U6.24(IO2)
IO4: R27.2 U6.26(IO4)
IO12: R28.2 U6.14(IO12)
IO13: R30.2 U6.16(IO13)
IO14: R33.2 U6.13(IO14)
IO15: R31.2 U6.23(IO15)
JTDI: U2.110(PA15)
JTDO: U2.133(PB3)
JTRST: U2.134(PB4)
MPU_INT: U2.139(PB8)
PA0: U2.34(PA0)
PA1: U2.35(PA1)
PA8: U2.100(PA8)
PB0: U2.46(PB0)
PB1: U2.47(PB1)
PB12: U2.73(PB12)
PB13: U2.74(PB13)
PB14: U2.75(PB14)
PB15: U2.76(PB15)
PC0: U2.26(PC0)
PC1: U2.27(PC1)
PC2: U2.28(PC2)
PC3: U2.29(PC3)
PC4: U2.44(PC4)
PC5: U2.45(PC5)
PF3: U2.13(PF3)
PF4: U2.14(PF4)
PF5: U2.15(PF5)
PF6: U2.18(PF6)
PF7: U2.19(PF7)
PF8: U2.20(PF8)
PF9: U2.21(PF9)
POWER_IN: C8.1 CN1.1(+) CN2.1(+) D1.2 Q1.2(D)
RESET: C9.2 R7.1 SW2.1 SW2.2 U2.25(NRST)
RTS: Q5.2(E) R55.1 U19.24(RTS)
RXD: U21.6(2Y) U21.9(3A)
RXD_CH: U6.34(RXD0) U19.26(TXD)
SD_3V3: CARD1.4(VDD) R8.2 R10.2 R11.2 R16.2 R51.2 R52.2 R53.2
SD_CLK: U2.113(PC12)
SD_CMD: U2.116(PD2)
SD_D0: U2.98(PC8)
SD_D1: U2.99(PC9)
SD_D2: U2.111(PC10)
SD_D3: U2.112(PC11)
SDCLK: CARD1.5(CLK(SCLK)) R16.1 R33.1
SDCMD: CARD1.3(CMD(DI)) R11.1 R31.1
SPI1_MISO: U2.42(PA6)
SPI1_MOSI: U2.43(PA7)
SPI1_NSS: U2.40(PA4)
SPI1_SCK: U2.41(PA5)
SWCLK: J4.2 U2.109(PA14)
SWDIO: J4.1 U2.105(PA13)
TXD_CH: U6.35(TXD0) U19.25(RXD)
USART1_RX: U2.102(PA10) U6.28(IO17)
USART1_TX: U2.101(PA9) U6.27(IO16)
USART2_RX: U2.37(PA3) U21.8(3Y)
USART2_TX: U2.36(PA2) U21.1(1OE#) U21.2(1A) U21.13(4OE#)
USART3_RX: U2.70(PB11) U8.11(TXD1)
USART3_TX: U2.69(PB10) U8.12(RXD1)
V_BUS: L1.1 R37.1 USB3.2(VBUS) USB3.11(VBUS)
V_BUS_5V: C12.1 C15.1 C55.2 C71.2 C72.2 L1.2 R43.1 U7.3(VIN) U19.7(REGIN) U19.8(VBUS)
$1N14267: LED7.2(K) R29.1
$1N14270: LED3.2(K) R18.1
$1N14330: R4.2 U4.9(AD0)
$1N14338: C2.1 U4.10(REGOUT)
$1N14340: C6.1 U4.20(CPOUT)
$1N14347: B1.1 D3.2(A)
$1N14377: Q2.1(B) R55.2
$1N14378: Q5.1(B) R54.2
$1N14385: LED6.2(A) R37.2
$1N14386: C7.2 R9.2 U2.23(PH0) X2.2(OSC2)
$1N14387: C10.2 R9.1 U2.24(PH1) X2.1(OSC1)
$1N14408: C4.2 U2.9(PC15) X3.1(OSC1)
$1N14410: C1.1 C29.1 R12.2 U2.33(VDDA)
$1N14458: D4.1(A) Q1.1(G) R14.1 R17.2
$1N14472: C3.2 U2.8(PC14) X3.2(OSC2)
$1N14474: R15.1 U2.143(PDR_ON)
$1N14488: R43.2 U19.9(RST#)
$1N28853: R38.1 U5.4(EN)
$1N28855: C14.2 C16.2 C18.2 C106.2 L7.2 R1.1 R36.1
$1N28856: R36.2 R39.1 U5.3(FB)
$1N28858: C40.2 L7.1 U5.6(SW)
$1N28859: C40.1 U5.1(BST)
Net-(L2-1): L2.1 R5.2
Net-(LED2-2): LED2.2(K) R13.1

Not connected (* = marked no-connect by the designer): CARD1 9(CD)*; FPC1 3 4; FPC2 3 4; FPC3 3 4; FPC4 3 4; U2 1(PE2) 2(PE3) 3(PE4) 4(PE5) 5(PE6) 7(PC13) 10(PF0) 11(PF1) 12(PF2) 22(PF10) 32(VREF+) 49(PF11) 50(PF12) 53(PF13) 54(PF14) 55(PF15) 56(PG0) 57(PG1) 58(PE7) 59(PE8) 60(PE9) 63(PE10) 64(PE11) 65(PE12) 66(PE13) 67(PE14) 68(PE15) 71(VCAP_1) 77(PD8) 78(PD9) 85(PD14) 86(PD15) 87(PG2) 88(PG3) 89(PG4) 90(PG5) 91(PG6) 92(PG7) 93(PG8) 96(PC6) 97(PC7) 103(PA11) 104(PA12) 106(VCAP_2) 114(PD0) 115(PD1) 117(PD3) 118(PD4) 119(PD5) 122(PD6) 123(PD7) 124(PG9) 125(PG10) 126(PG11) 127(PG12) 128(PG13) 129(PG14) 132(PG15) 135(PB5) 140(PB9) 141(PE0) 142(PE1); U3 4(NC); U4 2(NC) 3(NC) 4(NC) 5(NC) 6(AUX_DA) 7(AUX_CL) 14(NC) 15(NC) 16(NC) 17(NC) 19(RESV) 21(RESV) 22(RESV) 25(EP); U6 4(SENSOR_VP) 5(SENSOR_VN) 6(IO34) 7(IO35) 8(IO32) 9(IO33) 10(IO25) 11(IO26) 12(IO27) 17(NC) 18(NC) 19(NC) 20(NC) 21(NC) 22(NC) 29(IO5) 30(IO18) 31(IO19) 32(NC) 33(IO21) 36(IO22) 37(IO23); U8 1(VCC) 3(EN) 4(SYNC_OUT) 5(SYNC_IN) 6(RXD2) 7(TXD2) 9(IO5) 10(RSV1) 13(RSV2) 14(CAN_RX) 15(CAN_TX) 16(RSV3) 17(RSV4) 18(NRST); U19 1(DCD) 2(RI) 10(NC) 11(SUSPEND#) 12(SUSPEND) 13(NC) 14(NC) 15(NC) 16(NC) 17(NC) 18(NC) 19(NC) 20(NC) 21(NC) 22(NC) 23(CTS) 27(DSR) 29(EP); USB3 3(SBU2) 4(CC1) 9(SBU1) 10(CC2)

## Notes on the sheet
- 单总线
- SD卡
- IMU部分
- 12V---5V
- 供电
- IMU ch100
- VFB = 0.8V
- VOUT = VFB * (R36 + R39) / R39
- Battery
- 防反接
- 自动下载
- 5V---3.3V
- LED
- 下载口
- BOOT电路
- USB 转 TTL以及自动下载电路
